# EAGLE design Header - Digital Pot 4131 with Transistor (EAGLE 6.3)
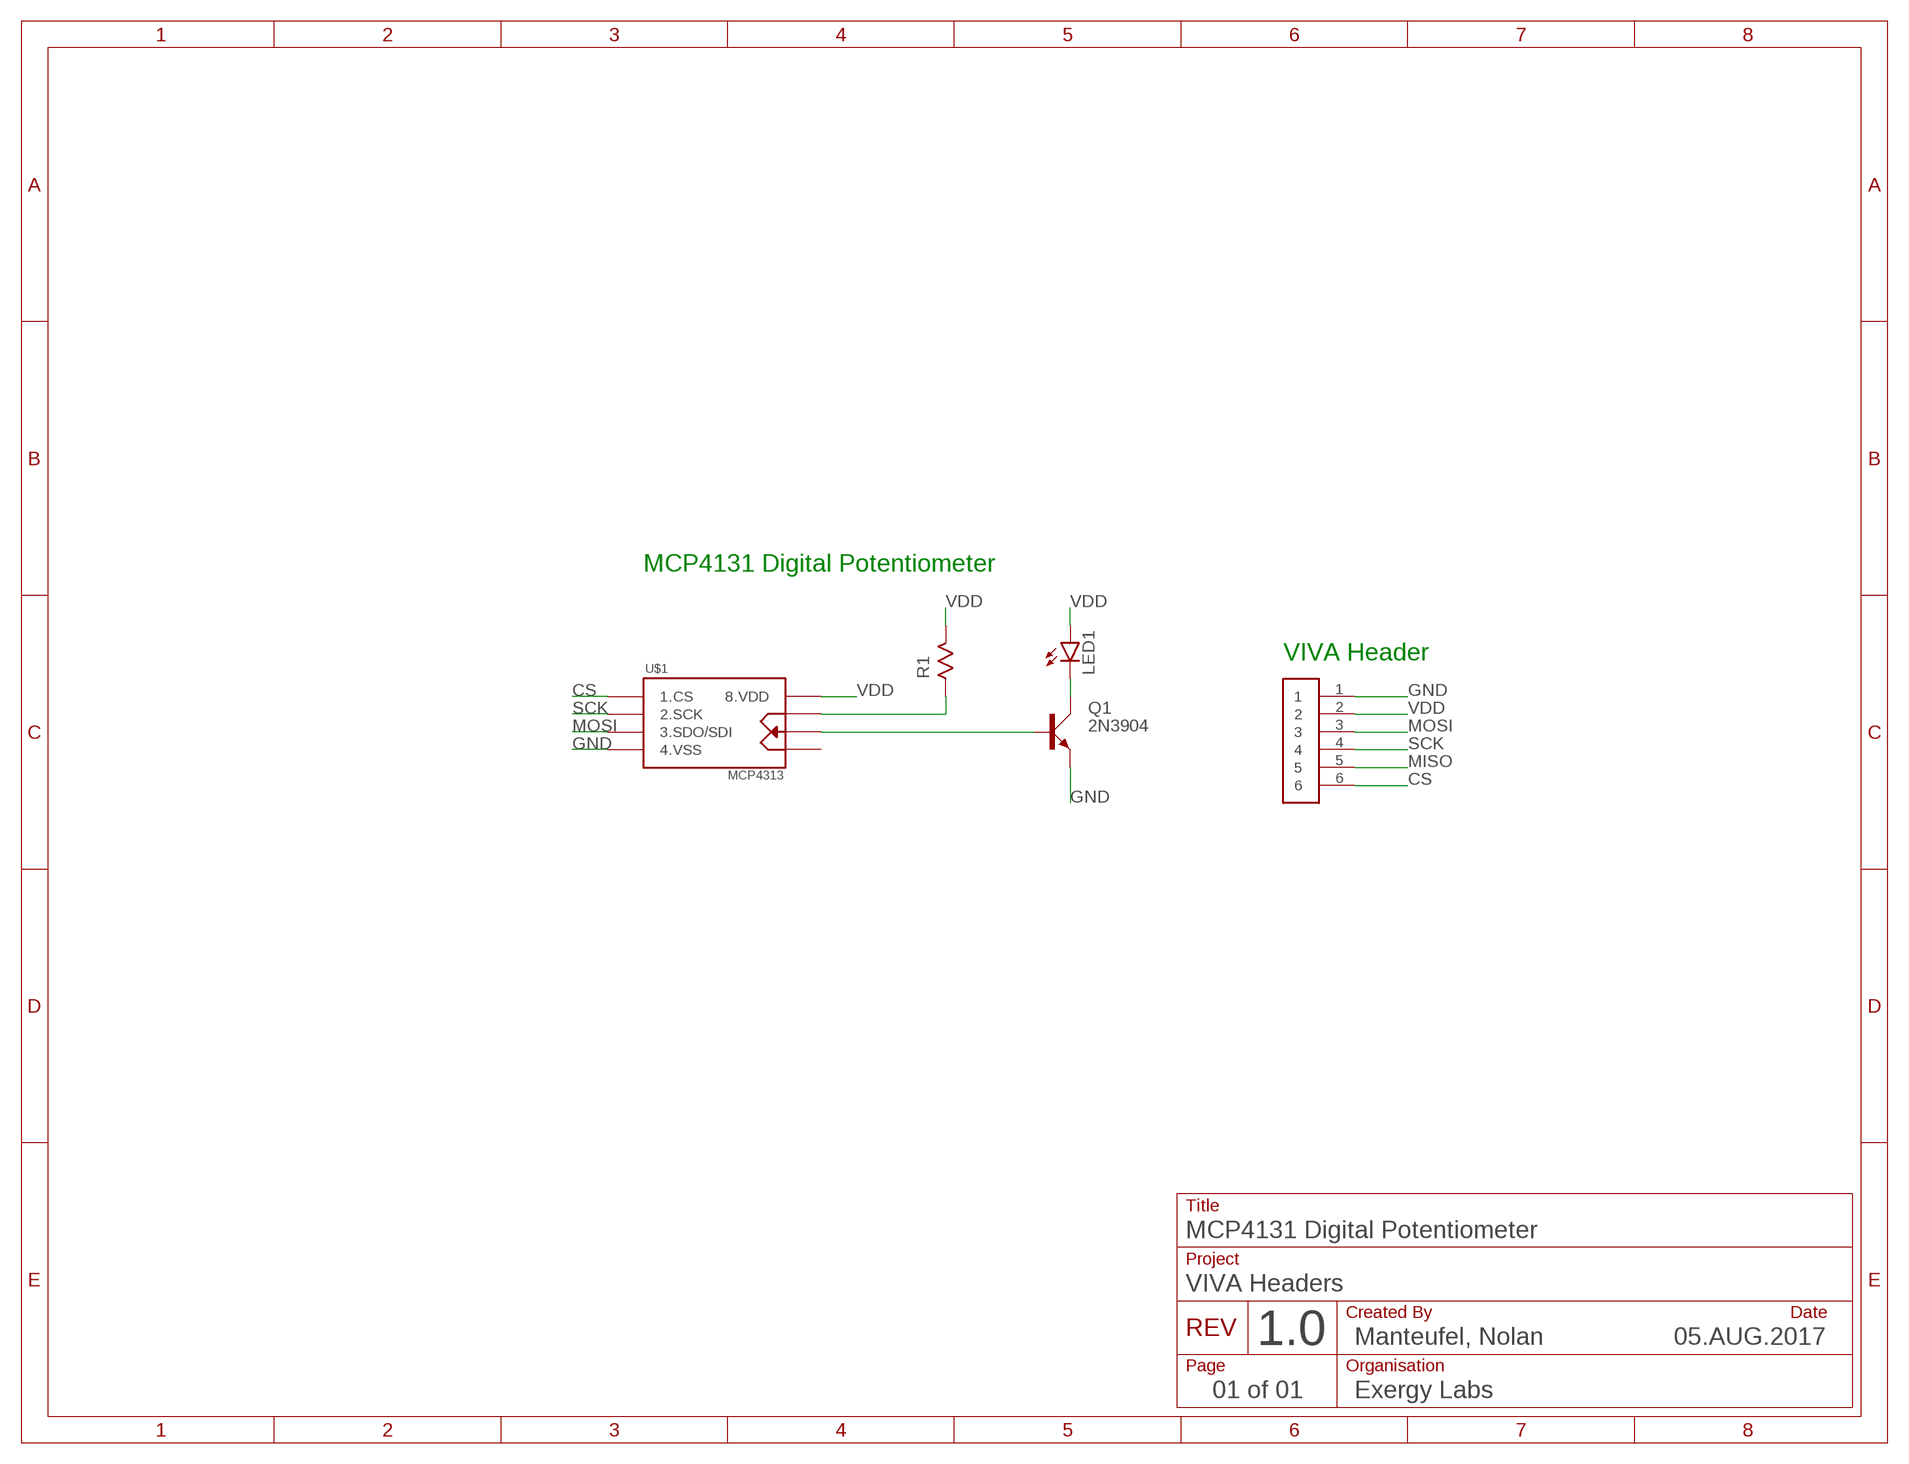
[diagram p0: schematic, sheet 1]

## Parts
LED1  LED5MM  [LED5MM]
Q1  2N3904  2N3904TO92-EBC-OVAL  [TO92-EBC-OVAL]
R1  R204-7  [0204/7]
U$1  MCP4131  [DIL08]
U$2  PINS_6SQUARE  [PINS_6]

## Nets
CS: U$1.1(1.CS) U$2.6
GND: Q1.E U$1.4(4.VSS) U$2.1
MISO: U$2.5
MOSI: U$1.3(3.SDO/SDI) U$2.3
N$1: LED1.K(C) Q1.C
N$2: Q1.B U$1.6(6.P0W)
N$9: R1.1 U$1.7(7.P0B)
SCK: U$1.2(2.SCK) U$2.4
VDD: LED1.A R1.2 U$1.8(8.VDD) U$2.2
Unconnected: U$1.5(5.P0A)

## Notes on the sheet
- MCP4131 Digital Potentiometer
- VIVA Header
- Title
- MCP4131 Digital Potentiometer
- Project
- VIVA Headers
- Created By | Date
- 05.AUG.2017
- REV
- 1.0 | Manteufel, Nolan
- Page | Organisation
- 01 of 01 | Exergy Labs

## Library data of the parts
LED1 = nolan-utsa:LED: LED OSRAM: - CHIPLED LG R971, LG N971, LY N971, LG Q971, LY Q971, LO R971, LY R971 LH N974, LH R974 LS Q976, LO Q976, LY Q976 LO Q996 - Hyper CHIPLED LW Q18S LB Q993, LB Q99A, LB R99A - SideLED LS A670, LO A670, LY A670, LG A670, LP A670 LB A673, LV A673, LT A673, LW A673 LH A674 LY A675 LS A676, LA A676, LO A676, LY A676, LW A676 LS A679, LY A679, LG A679 - Hyper Micro SIDELED® LS Y876, LA Y876, LO Y876, LY Y876 LT Y87S - SmartLED LW L88C, LW L88S LB L89C, LB L89S, LG L890 LS L89K, LO L89K, LY L89K LS L896, LA L896, LO L896, LY L896 - TOPLED LS T670, LO T670, LY T670, LG T670, LP T670 LSG T670, LSP T670, LSY T670, LOP T670, LYG T670 LG T671, LOG T671, LSG T671 LB T673, LV T673, LT T673, LW T673 LH T674 LS T676, LA T676, LO T676, LY T676, LB T676, LH T676, LSB T676, LW T676 LB T67C, LV T67C, LT T67C, LS T67K, LO T67K, LY T67K, LW E67C LS E67B, LA E67B, LO E67B, LY E67B, LB E67C, LV E67C, LT E67C LW T67C LS T679, LY T679, LG T679 LS T770, LO T770, LY T770, LG T770, LP T770 LB T773, LV T773, LT T773, LW T773 LH T774 LS E675, LA E675, LY E675, LS T675 LS T776, LA T776, LO T776, LY T776, LB T776 LHGB T686 LT T68C, LB T68C - Hyper Mini TOPLED® LB M676 - Mini TOPLED Santana® LG M470 LS M47K, LO M47K, LY M47K Source: http://www.osram.convergy.de LUXEON: - LUMILED® LXK2-PW12-R00, LXK2-PW12-S00, LXK2-PW14-U00, LXK2-PW14-V00 LXK2-PM12-R00, LXK2-PM12-S00, LXK2-PM14-U00 LXK2-PE12-Q00, LXK2-PE12-R00, LXK2-PE12-S00, LXK2-PE14-T00, LXK2-PE14-U00 LXK2-PB12-K00, LXK2-PB12-L00, LXK2-PB12-M00, LXK2-PB14-N00, LXK2-PB14-P00, LXK2-PB14-Q00 LXK2-PR12-L00, LXK2-PR12-M00, LXK2-PR14-Q00, LXK2-PR14-R00 LXK2-PD12-Q00, LXK2-PD12-R00, LXK2-PD12-S00 LXK2-PH12-R00, LXK2-PH12-S00 LXK2-PL12-P00, LXK2-PL12-Q00, LXK2-PL12-R00 Source: www.luxeon.com KINGBRIGHT: KA-3528ASYC Source: www.kingbright.com
Q1 = nolan-utsa:2N3904: NPN TRANSISTOR
R1 = nolan-utsa:R
U$1 = nolan-utsa:MCP4131
U$2 = nolan-utsa:PINS_6

## Board
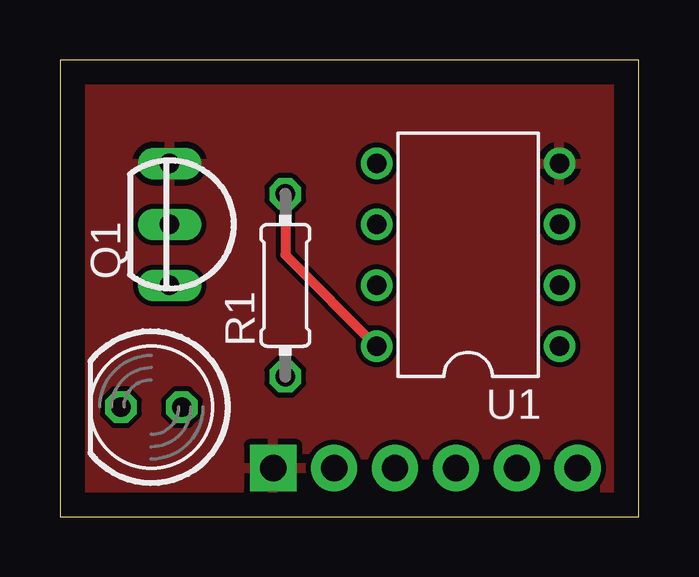
[diagram p1: board, top side]
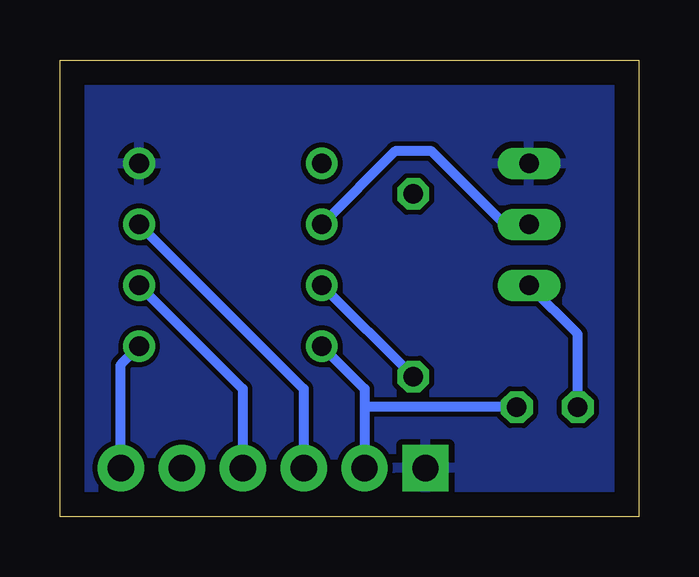
[diagram p2: board, bottom side, seen from below]

Size 24.13 x 19.05 mm. Coordinates in mm from the lower left corner, seen from the top.
Outline: 0,0 24.13,0 24.13,19.05 0,19.05 0,0
Copper layers (1*16): Top 0.035mm / dielectric 1.5mm / Bottom 0.035mm
Design rules "default": minimum track width 10mil, minimum drill 24mil, track to track 8mil, track to pad 8mil, pad to pad 8mil, via to via 8mil, smd to smd 8mil, copper to edge 40mil, drill to drill 8mil, minimum pad ring 10mil, minimum via ring 8mil, stop-mask expansion 4mil, vias tented up to drill 0mil, thermal gap 10mil

### Footprints (pad centres in the part's own frame; a part is rotated, then mirrored left to right if it is on the bottom)
LED5MM = drill 0.813 octagon: A -1.27,0; K 1.27,0
TO92-EBC-OVAL = drill 0.813 long: B 0,-1.27; C 2.54,-1.27; E -2.54,-1.27
0204/7 = drill 0.813 octagon: 1 -3.81,0; 2 3.81,0
DIL08 = drill 0.813 pad 1.27: 1 -3.81,-3.81; 2 -1.27,-3.81; 3 1.27,-3.81; 4 3.81,-3.81; 5 3.81,3.81; 6 1.27,3.81; 7 -1.27,3.81; 8 -3.81,3.81
PINS_6 = drill 1.1 pad 1.93 square: 1 0,0 | drill 1.1 pad 1.93: 2 2.54,0; 3 5.08,0; 4 7.62,0; 5 10.16,0; 6 12.7,0

### Placement (x,y rotation side)
LED1  3.81,4.57 180 top
Q1  5.84,12.19 270 top
R1  9.4,9.65 90 top
U$1  17.02,10.92 90 top
U$2  8.89,2.03 0 top

### Tracks (layer width: path | path; a pad name or v marks a point on that pad's centre or on a via)
CS
  Bottom 0.406: U$1.1 21.59,6.35 U$2.6
GND
  pour Bottom: 0.51,0.51 23.62,0.51 23.62,18.54 0.51,18.54
  pour Top: 0.51,0.51 23.62,0.51 23.62,18.54 0.51,18.54
MOSI
  Bottom 0.406: U$1.3 13.97,5.33 U$2.3
N$1
  Bottom 0.406: LED1.K 2.54,7.62 Q1.C 5.59,9.65
N$2
  Bottom 0.406: Q1.B 5.59,12.19 8.64,15.24 10.16,15.24 U$1.6
N$9
  Bottom 0.406: R1.1 U$1.7
SCK
  Bottom 0.406: U$1.2 16.51,5.33 U$2.4
VDD
  Top 0.406: R1.2 9.4,10.92 U$1.8
  Bottom 0.406: U$1.8 11.43,5.33 11.43,4.57 | 11.43,4.57 U$2.2 | LED1.A 11.43,4.57

### Text on the board
tPlace: Q1 | R1 | U1